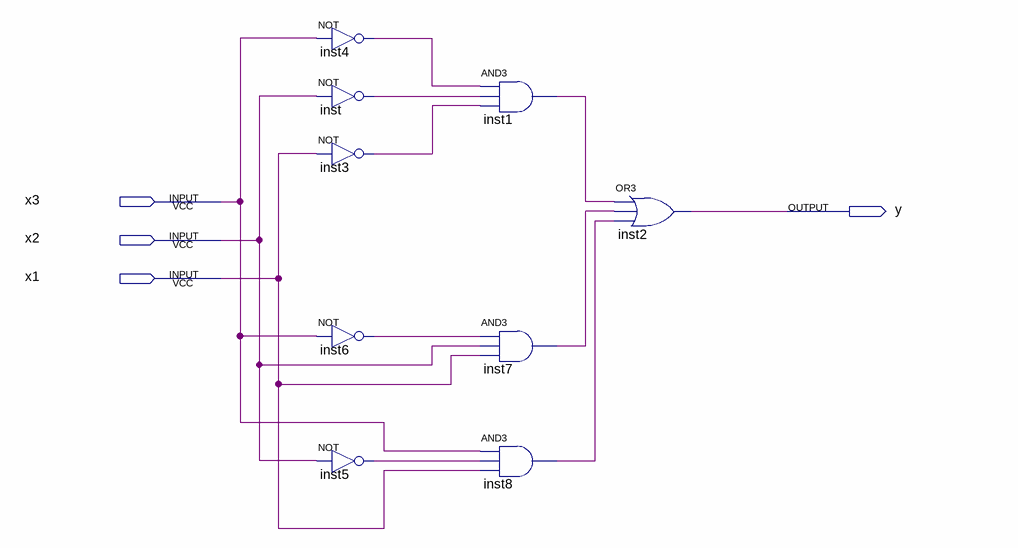
[diagram p0: schematic sheet]
// Quartus schematic block1.bdf as structural Verilog: 9 symbols, 4 pins
module block1 (
  input  x3,
  input  x2,
  input  x1,
  output y
);

  wire inst1_out, inst3_out, inst4_out, inst5_out, inst6_out, inst7_out, inst8_out, inst_out;

  not inst4 (inst4_out, x3);
  not inst (inst_out, x2);
  not inst3 (inst3_out, x1);
  not inst6 (inst6_out, x3);
  not inst5 (inst5_out, x2);
  and inst1 (inst1_out, inst4_out, inst_out, inst3_out);
  and inst7 (inst7_out, inst6_out, x2, x1);
  and inst8 (inst8_out, x3, inst5_out, x1);
  or inst2 (y, inst1_out, inst7_out, inst8_out);
endmodule
